# EAGLE design MC-test-simple (EAGLE 8.6.0)
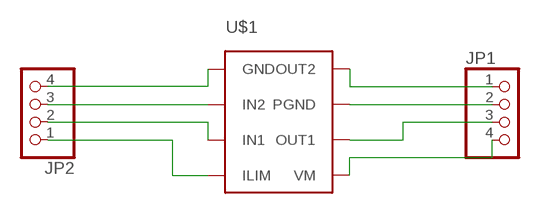
[diagram p0: schematic, sheet 1]

## Parts
JP1  PINHD-1X4  [1X04]
JP2  PINHD-1X4  [1X04]
U$1  DRV8871  [SO-8_POWERPAD]

## Nets
GND: JP1.2 JP2.4 U$1.1(GND) U$1.7(PGND)
ILIM: JP2.1 U$1.4(ILIM)
IN1: JP2.2 U$1.3(IN1)
IN2: JP2.3 U$1.2(IN2)
OUT1: JP1.3 U$1.6(OUT1)
OUT2: JP1.1 U$1.8(OUT2)
VM: JP1.4 U$1.5(VM)

## Library data of the parts
JP1 JP2 = pinhead:PINHD-1X4: PIN HEADER
U$1 = Parts:DRV8871

## Board
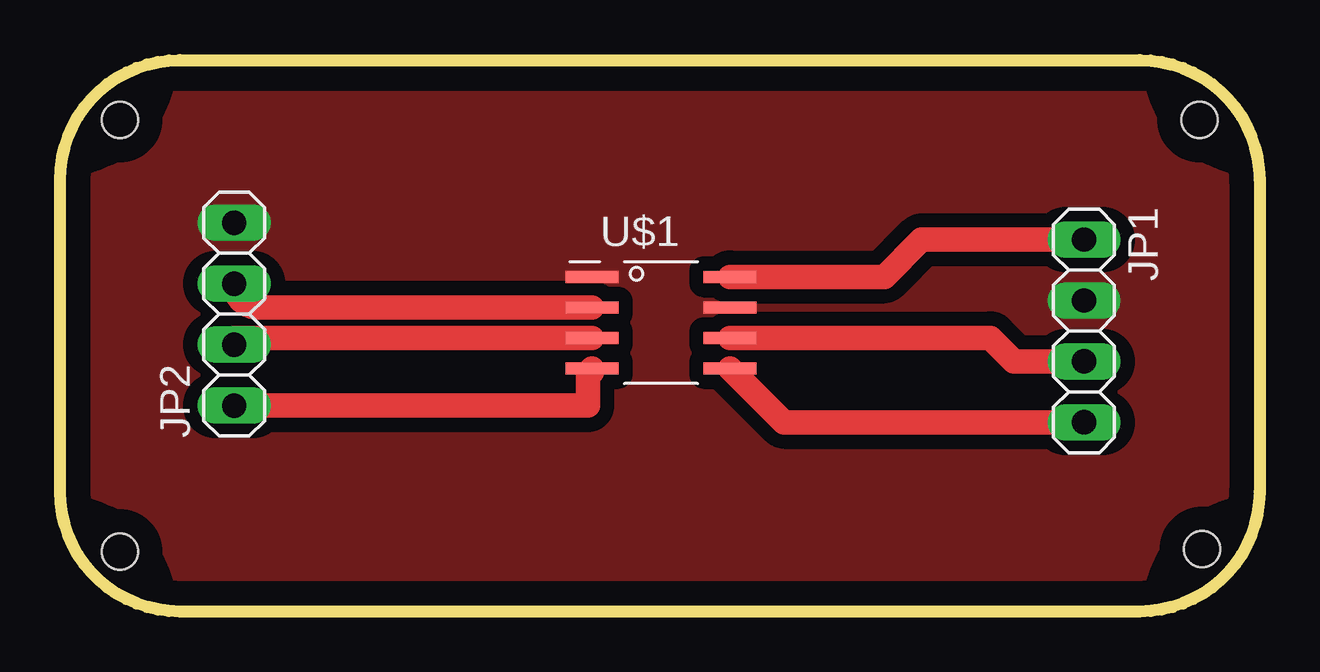
[diagram p1: board, top side]
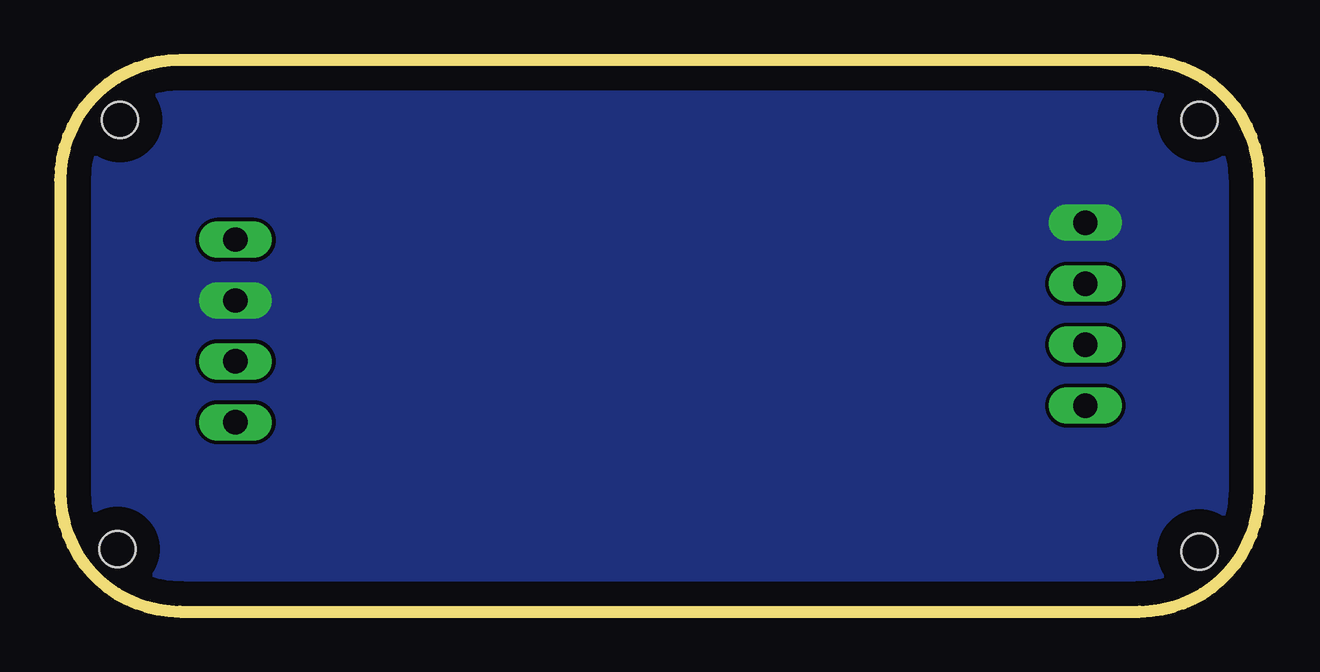
[diagram p2: board, bottom side, seen from below]

Size 50 x 23 mm. Coordinates in mm from the lower left corner, seen from the top.
Outline: 0,18 arc-90 5,23 45,23 arc-90 50,18 50,5 arc-90 45,0 5,0 arc-90 0,5 0,18
Copper layers (1*16): Top 0.035mm / dielectric 1.5mm / Bottom 0.035mm
Design rules "default": minimum track width 6mil, minimum drill 0.35mm, track to track 6mil, track to pad 6mil, pad to pad 6mil, via to via 6mil, smd to smd 6mil, copper to edge 40mil, drill to drill 6mil, minimum pad ring 10mil, minimum via ring 8mil, stop-mask expansion 4mil, vias tented up to drill 0mil, thermal gap 10mil
Holes 1.5 mm at 2.5,20.5 47.5,20.5 47.6,2.6 2.5,2.5

### Footprints (pad centres in the part's own frame; a part is rotated, then mirrored left to right if it is on the bottom)
1X04 = drill 1.016 long: 1 -3.81,0; 2 -1.27,0; 3 1.27,0; 4 3.81,0
SO-8_POWERPAD = smd 0.5 x 2.2: 1 -1.905,-2.875; 2 -0.635,-2.875; 3 0.635,-2.875; 4 1.905,-2.875; 5 1.905,2.875; 6 0.635,2.875; 7 -0.635,2.875; 8 -1.905,2.875

### Placement (x,y rotation side)
JP1  42.68,11.7 270 top
JP2  7.26,12.4 90 top
U$1  25.05,12.05 270 top

### Tracks (layer width: path | path; a pad name or v marks a point on that pad's centre or on a via)
GND
  pour Bottom (no thermals): 5,37 arc-90 0,32 0,-8 arc-90 5,-13 45,-13 arc-90 50,-8 50,32 arc-90 45,37
  pour Top (isolate 0.6, no thermals): 5,23 arc-90 0,18 0,5 arc-90 5,0 45,0 arc-90 50,5 50,18 arc-90 45,23
ILIM
  Top 1.016: JP2.1 22,8.59 22,10 22.18,10 U$1.4
IN1
  Top 1.016: U$1.3 7.26,11.41 JP2.2
IN2
  Top 1.016: U$1.2 8.25,12.69 arc-90 JP2.3
OUT1
  Top 1.016: U$1.6 38.78,11.41 39.77,10.43 JP1.3
OUT2
  Top 1.016: U$1.8 34.36,13.96 35.91,15.51 JP1.1
VM
  Top 1.016: U$1.5 30.18,7.89 JP1.4